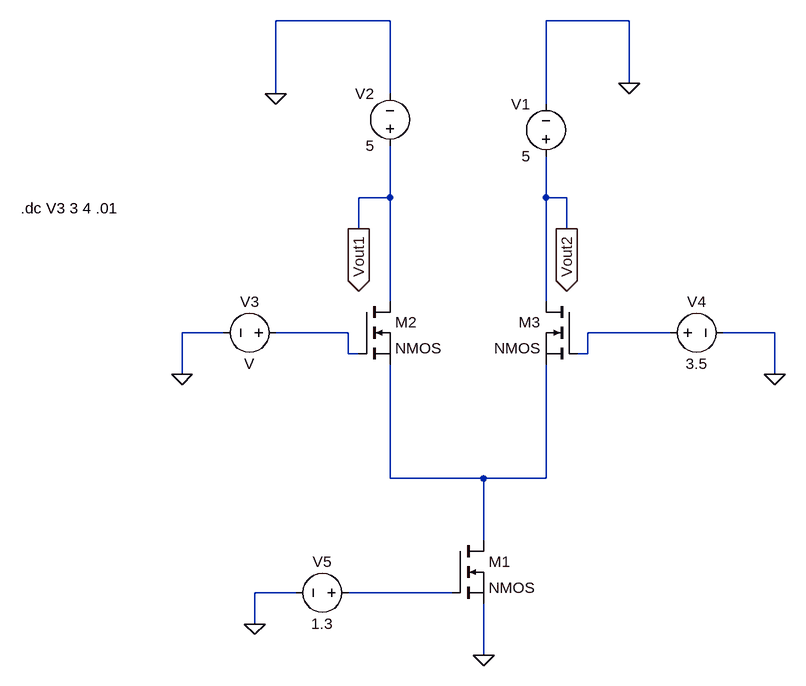
[diagram p0: schematic thomasPostlab.asc]
thomasPostlab.asc, the LTspice schematic file:
Version 4
SHEET 1 1056 1104
WIRE 320 112 144 112
WIRE 688 112 560 112
WIRE 688 208 688 112
WIRE 144 224 144 112
WIRE 320 224 320 112
WIRE 560 240 560 112
WIRE 320 384 320 304
WIRE 320 384 272 384
WIRE 560 384 560 320
WIRE 592 384 560 384
WIRE 272 432 272 384
WIRE 592 432 592 384
WIRE 320 544 320 384
WIRE 560 544 560 384
WIRE 64 592 0 592
WIRE 256 592 144 592
WIRE 752 592 624 592
WIRE 912 592 832 592
WIRE 256 624 256 592
WIRE 272 624 256 624
WIRE 624 624 624 592
WIRE 624 624 608 624
WIRE 0 656 0 592
WIRE 912 656 912 592
WIRE 320 816 320 640
WIRE 464 816 320 816
WIRE 560 816 560 640
WIRE 560 816 464 816
WIRE 464 912 464 816
WIRE 176 992 112 992
WIRE 416 992 256 992
WIRE 112 1040 112 992
WIRE 464 1088 464 1008
FLAG 0 656 0
FLAG 912 656 0
FLAG 112 1040 0
FLAG 464 1088 0
FLAG 272 432 Vout1
IOPIN 272 432 Out
FLAG 592 432 Vout2
IOPIN 592 432 Out
FLAG 144 224 0
FLAG 688 208 0
SYMBOL voltage 160 592 R90
WINDOW 0 -32 56 VBottom 2
WINDOW 3 32 56 VTop 2
SYMATTR InstName V3
SYMBOL voltage 736 592 R270
WINDOW 0 32 56 VTop 2
WINDOW 3 -32 56 VBottom 2
SYMATTR InstName V4
SYMATTR Value 3.5
SYMBOL nmos 272 544 R0
SYMATTR InstName M2
SYMBOL nmos 608 544 M0
SYMATTR InstName M3
SYMBOL nmos 416 912 R0
SYMATTR InstName M1
SYMBOL voltage 272 992 R90
WINDOW 0 -32 56 VBottom 2
WINDOW 3 32 56 VTop 2
SYMATTR InstName V5
SYMATTR Value 1.3
SYMBOL voltage 560 336 R180
WINDOW 0 24 96 Left 2
WINDOW 3 24 16 Left 2
SYMATTR InstName V1
SYMATTR Value 5
SYMBOL voltage 320 320 R180
WINDOW 0 24 96 Left 2
WINDOW 3 24 16 Left 2
SYMATTR InstName V2
SYMATTR Value 5
TEXT -248 400 Left 2 !.dc V3 3 4 .01

The netlist it stands for:
* thomasPostlab.asc
V3 N001 0 V
V4 N002 0 3.5
M2 Vout1 N001 N003 N003 NMOS
M3 Vout2 N002 N003 N003 NMOS
M1 N003 N004 0 0 NMOS
V5 N004 0 1.3
V1 Vout2 0 5
V2 Vout1 0 5
.model NMOS NMOS
.model PMOS PMOS
.lib standard.mos
.dc V3 3 4 .01
.backanno
.end